# EAGLE schematic main_board_v1 (EAGLE 9.2.2)

## Sheet 1 of 7: MCU
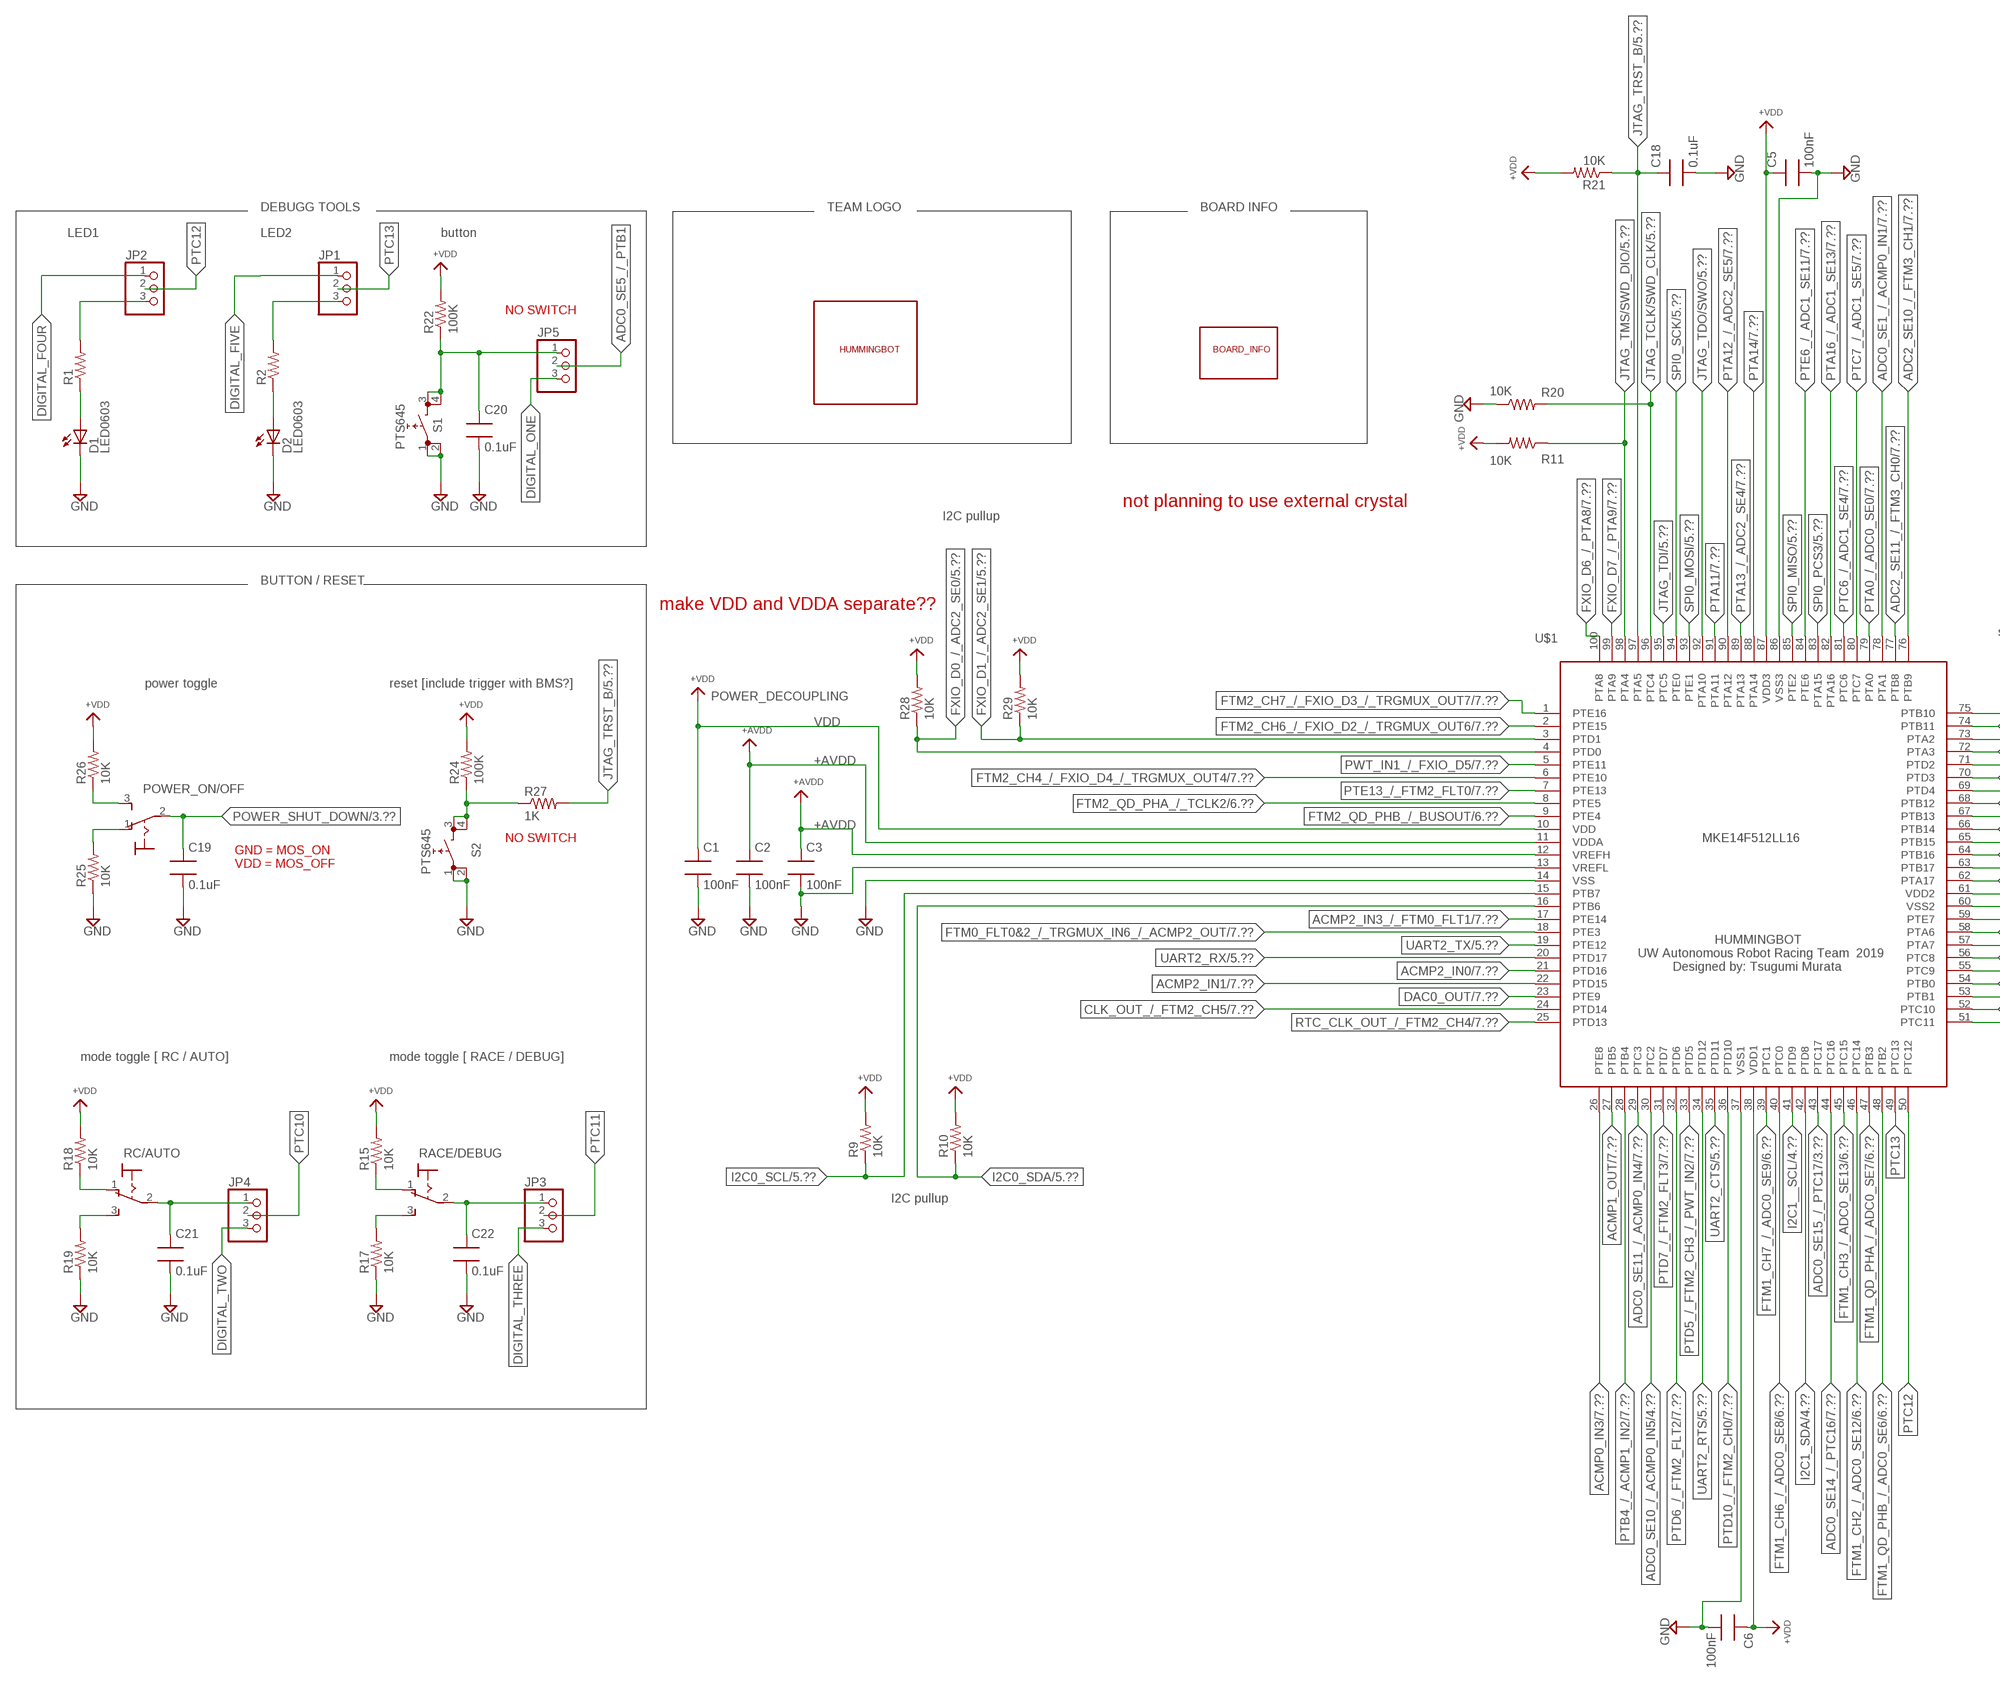
[diagram p0: schematic, sheet 1, part 1 of 2]
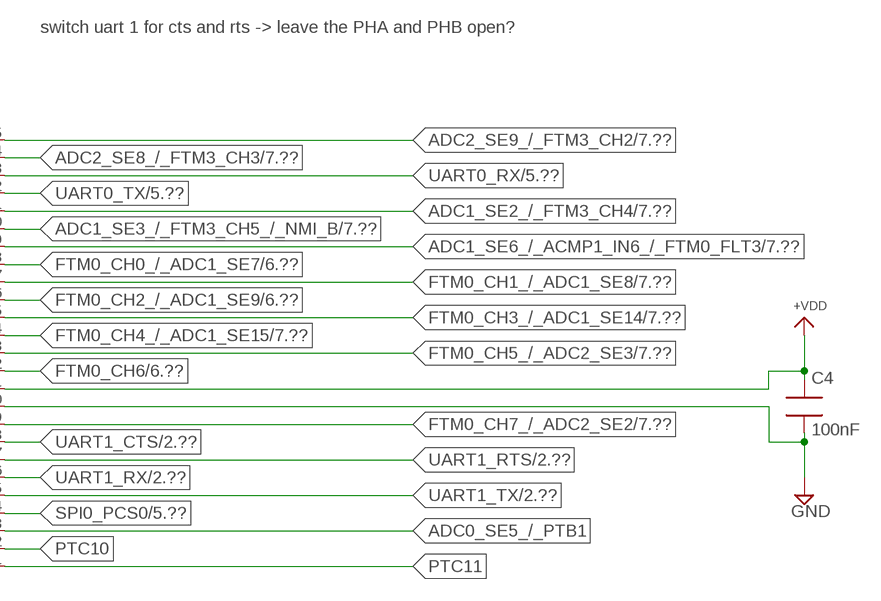
[diagram p1: schematic, sheet 1, part 2 of 2]

### Parts
C1  100nF  CAP0603  [0603SMT]
C2  100nF  CAP0603  [0603SMT]
C3  100nF  CAP0603  [0603SMT]
C4  100nF  CAP0603  [0603SMT]
C5  100nF  CAP0603  [0603SMT]
C6  100nF  CAP0603  [0603SMT]
C18  0.1uF  CAP0603  [0603SMT]
C19  0.1uF  CAP0603  [0603SMT]
C20  0.1uF  CAP0603  [0603SMT]
C21  0.1uF  CAP0603  [0603SMT]
C22  0.1uF  CAP0603  [0603SMT]
D1  LED0603  [0603SMT]
D2  LED0603  [0603SMT]
JP1  PINHD-1X3  [1X03]
JP2  PINHD-1X3  [1X03]
JP3  PINHD-1X3  [1X03]
JP4  PINHD-1X3  [1X03]
JP5  PINHD-1X3  [1X03]
POWER_ON/OFF  320-916  [320-916]
R1  RES0603  [0603SMT]
R2  RES0603  [0603SMT]
R9  10K  RES0603  [0603SMT]
R10  10K  RES0603  [0603SMT]
R11  10K  RES0603  [0603SMT]
R15  10K  RES0603  [0603SMT]
R17  10K  RES0603  [0603SMT]
R18  10K  RES0603  [0603SMT]
R19  10K  RES0603  [0603SMT]
R20  10K  RES0603  [0603SMT]
R21  10K  RES0603  [0603SMT]
R22  100K  RES0603  [0603SMT]
R24  100K  RES0603  [0603SMT]
R25  10K  RES0603  [0603SMT]
R26  10K  RES0603  [0603SMT]
R27  1K  RES0603  [0603SMT]
R28  10K  RES0603  [0603SMT]
R29  10K  RES0603  [0603SMT]
RACE/DEBUG  320-916  [320-916]
RC/AUTO  320-916  [320-916]
S1  PTS645  TACT_SWITCH_6X6_SMT  [TACT_SWITCH_SMT]
S2  PTS645  TACT_SWITCH_6X6_SMT  [TACT_SWITCH_SMT]
U$1  MKE14F512LL16  [LQFP100]
U$12  TEAM_LOGO  [TEAM_LOGO]
U$38  BOARD_INFO  [BOARD_INFO]

### Nets
+AVDD: C2.1 C3.1 U$1.11(VDDA) U$1.12(VREFH)
ACMP0_IN3: U$1.26(PTE8) ; also sheet 7
ACMP1_OUT: U$1.27(PTB5) ; also sheet 7
ACMP2_IN0: U$1.21(PTD16) ; also sheet 7
ACMP2_IN1: U$1.22(PTD15) ; also sheet 7
ACMP2_IN3_/_FTM0_FLT1: U$1.17(PTE14) ; also sheet 7
ADC0_SE1_/_ACMP0_IN1: U$1.78(PTA1) ; also sheet 7
ADC0_SE5_/_PTB1: JP5.2 U$1.53(PTB1)
ADC0_SE10_/_ACMP0_IN5: U$1.30(PTC2) ; also sheet 4,7
ADC0_SE11_/_ACMP0_IN4: U$1.29(PTC3) ; also sheet 7
ADC0_SE14_/_PTC16: U$1.44(PTC16) ; also sheet 7
ADC0_SE15_/_PTC17: U$1.43(PTC17) ; also sheet 3,7
ADC1_SE2_/_FTM3_CH4: U$1.71(PTD2) ; also sheet 7
ADC1_SE3_/_FTM3_CH5_/_NMI_B: U$1.70(PTD3) ; also sheet 7
ADC1_SE6_/_ACMP1_IN6_/_FTM0_FLT3: U$1.69(PTD4) ; also sheet 7
ADC2_SE8_/_FTM3_CH3: U$1.74(PTB11) ; also sheet 7
ADC2_SE9_/_FTM3_CH2: U$1.75(PTB10) ; also sheet 7
ADC2_SE10_/_FTM3_CH1: U$1.76(PTB9) ; also sheet 7
ADC2_SE11_/_FTM3_CH0: U$1.77(PTB8) ; also sheet 7
CLK_OUT_/_FTM2_CH5: U$1.24(PTD14) ; also sheet 7
DAC0_OUT: U$1.23(PTE9) ; also sheet 7
DIGITAL_FIVE: JP1.1
DIGITAL_FOUR: JP2.1
DIGITAL_ONE: JP5.3
DIGITAL_THREE: JP3.3
DIGITAL_TWO: JP4.3
FTM0_CH0_/_ADC1_SE7: U$1.68(PTB12) ; also sheet 6,7
FTM0_CH1_/_ADC1_SE8: U$1.67(PTB13) ; also sheet 7
FTM0_CH2_/_ADC1_SE9: U$1.66(PTB14) ; also sheet 6,7
FTM0_CH3_/_ADC1_SE14: U$1.65(PTB15) ; also sheet 7
FTM0_CH4_/_ADC1_SE15: U$1.64(PTB16) ; also sheet 7
FTM0_CH5_/_ADC2_SE3: U$1.63(PTB17) ; also sheet 7
FTM0_CH6: U$1.62(PTA17) ; also sheet 6,7
FTM0_CH7_/_ADC2_SE2: U$1.59(PTE7) ; also sheet 7
FTM0_FLT0&2_/_TRGMUX_IN6_/_ACMP2_OUT: U$1.18(PTE3) ; also sheet 7
FTM1_CH2_/_ADC0_SE12: U$1.46(PTC14) ; also sheet 6
FTM1_CH3_/_ADC0_SE13: U$1.45(PTC15) ; also sheet 6
FTM1_CH6_/_ADC0_SE8: U$1.40(PTC0) ; also sheet 6
FTM1_CH7_/_ADC0_SE9: U$1.39(PTC1) ; also sheet 6
FTM1_QD_PHA_/_ADC0_SE7: U$1.47(PTB3) ; also sheet 6
FTM1_QD_PHB_/_ADC0_SE6: U$1.48(PTB2) ; also sheet 6
FTM2_CH4_/_FXIO_D4_/_TRGMUX_OUT4: U$1.6(PTE10) ; also sheet 7
FTM2_CH6_/_FXIO_D2_/_TRGMUX_OUT6: U$1.2(PTE15) ; also sheet 7
FTM2_CH7_/_FXIO_D3_/_TRGMUX_OUT7: U$1.1(PTE16) ; also sheet 7
FTM2_QD_PHA_/_TCLK2: U$1.8(PTE5) ; also sheet 6
FTM2_QD_PHB_/_BUSOUT: U$1.9(PTE4) ; also sheet 6
FXIO_D0_/_ADC2_SE0: R28.1 U$1.4(PTD0) ; also sheet 5,7
FXIO_D1_/_ADC2_SE1: R29.1 U$1.3(PTD1) ; also sheet 5,7
FXIO_D6_/_PTA8: U$1.100(PTA8) ; also sheet 7
FXIO_D7_/_PTA9: U$1.99(PTA9) ; also sheet 7
GND: C1.2 C2.2 C3.2 C4.2 C5.2 C6.2 C18.2 C19.2 C20.2 C21.2 C22.2 D1.2(C) D2.2(C) R17.1 R19.1 R20.1 R25.1 S1.1 S1.2 S2.1 S2.2 U$1.13(VREFL) U$1.14(VSS) U$1.37(VSS1) U$1.60(VSS2) U$1.86(VSS3) ; also sheet 2,3,4,5,6,7
I2C0_SCL: R9.1 U$1.15(PTB7) ; also sheet 5
I2C0_SDA: R10.1 U$1.16(PTB6) ; also sheet 5
I2C1__SCL: U$1.41(PTD9) ; also sheet 4
I2C1_SDA: U$1.42(PTD8) ; also sheet 4
JTAG_TCLK/SWD_CLK: R20.2 U$1.96(PTC4) ; also sheet 5
JTAG_TDI: U$1.95(PTC5) ; also sheet 5
JTAG_TDO/SWO: U$1.92(PTA10) ; also sheet 5
JTAG_TMS/SWD_DIO: R11.1 U$1.98(PTA4) ; also sheet 5
JTAG_TRST_B: C18.1 R21.1 R24.1 R27.1 R27.2 S2.3 S2.4 U$1.97(PTA5) ; also sheet 5
N$3: D1.1(A) R1.1
N$4: C22.1 JP3.1 RACE/DEBUG.2(P)
N$5: D2.1(A) R2.1
N$6: JP1.3 R2.2
N$7: JP2.3 R1.2
N$26: R15.1 RACE/DEBUG.1(O)
N$28: R17.2 RACE/DEBUG.3(S)
N$31: C21.1 JP4.1 RC/AUTO.2(P)
N$32: R18.1 RC/AUTO.1(O)
N$33: R19.2 RC/AUTO.3(S)
N$41: C20.1 JP5.1 R22.1 S1.3 S1.4
N$45: POWER_ON/OFF.3(S) R26.1
N$46: POWER_ON/OFF.1(O) R25.2
POWER_SHUT_DOWN: C19.1 POWER_ON/OFF.2(P) ; also sheet 3
PTA0_/_ADC0_SE0: U$1.79(PTA0) ; also sheet 7
PTA11: U$1.91(PTA11) ; also sheet 7
PTA12_/_ADC2_SE5: U$1.90(PTA12) ; also sheet 7
PTA13_/_ADC2_SE4: U$1.89(PTA13) ; also sheet 7
PTA14: U$1.88(PTA14) ; also sheet 7
PTA16_/_ADC1_SE13: U$1.82(PTA16) ; also sheet 7
PTB4_/_ACMP1_IN2: U$1.28(PTB4) ; also sheet 7
PTC6_/_ADC1_SE4: U$1.81(PTC6) ; also sheet 7
PTC7_/_ADC1_SE5: U$1.80(PTC7) ; also sheet 7
PTC10: JP4.2 U$1.52(PTC10)
PTC11: JP3.2 U$1.51(PTC11)
PTC12: JP2.2 U$1.50(PTC12)
PTC13: JP1.2 U$1.49(PTC13)
PTD5_/_FTM2_CH3_/_PWT_IN2: U$1.33(PTD5) ; also sheet 7
PTD6_/_FTM2_FLT2: U$1.32(PTD6) ; also sheet 7
PTD7_/_FTM2_FLT3: U$1.31(PTD7) ; also sheet 7
PTD10_/_FTM2_CH0: U$1.36(PTD10) ; also sheet 7
PTE6_/_ADC1_SE11: U$1.84(PTE6) ; also sheet 7
PTE13_/_FTM2_FLT0: U$1.7(PTE13) ; also sheet 7
PWT_IN1_/_FXIO_D5: U$1.5(PTE11) ; also sheet 7
RTC_CLK_OUT_/_FTM2_CH4: U$1.25(PTD13) ; also sheet 7
SPI0_MISO: U$1.85(PTE2) ; also sheet 5
SPI0_MOSI: U$1.93(PTE1) ; also sheet 5
SPI0_PCS0: U$1.54(PTB0) ; also sheet 5
SPI0_PCS3: U$1.83(PTA15) ; also sheet 5
SPI0_SCK: U$1.94(PTE0) ; also sheet 5
UART0_RX: U$1.73(PTA2) ; also sheet 5
UART0_TX: U$1.72(PTA3) ; also sheet 5
UART1_CTS: U$1.58(PTA6) ; also sheet 2
UART1_RTS: U$1.57(PTA7) ; also sheet 2
UART1_RX: U$1.56(PTC8) ; also sheet 2
UART1_TX: U$1.55(PTC9) ; also sheet 2
UART2_CTS: U$1.35(PTD11) ; also sheet 5
UART2_RTS: U$1.34(PTD12) ; also sheet 5
UART2_RX: U$1.20(PTD17) ; also sheet 5
UART2_TX: U$1.19(PTE12) ; also sheet 5
VDD: C1.1 C4.1 C5.1 C6.1 R9.2 R10.2 R11.2 R15.2 R18.2 R21.2 R22.2 R24.2 R26.2 R28.2 R29.2 U$1.10(VDD) U$1.38(VDD1) U$1.61(VDD2) U$1.87(VDD3) ; supply symbol labelled +VDD ; also sheet 5,6,7

### Notes on the sheet
- DEBUGG TOOLS | TEAM LOGO | BOARD INFO
- LED1 | LED2 | button
- NO SWITCH
- not planning to use external crystal
- I2C pullup
- BUTTON / RESET
- make VDD and VDDA separate??
- switch uart 1 for cts and rts -> leave the PHA and PHB open?
- power toggle | reset [include trigger with BMS?]
- POWER_DECOUPLING
- NO SWITCH
- GND = MOS_ON 
  VDD = MOS_OFF
- HUMMINGBOT 
  UW Autonomous Robot Racing Team  2019 
            Designed by: Tsugumi Murata
- mode toggle [ RC / AUTO] | mode toggle [ RACE / DEBUG]
- I2C pullup

## Sheet 2 of 7: USB Interface [Programming / Debug]
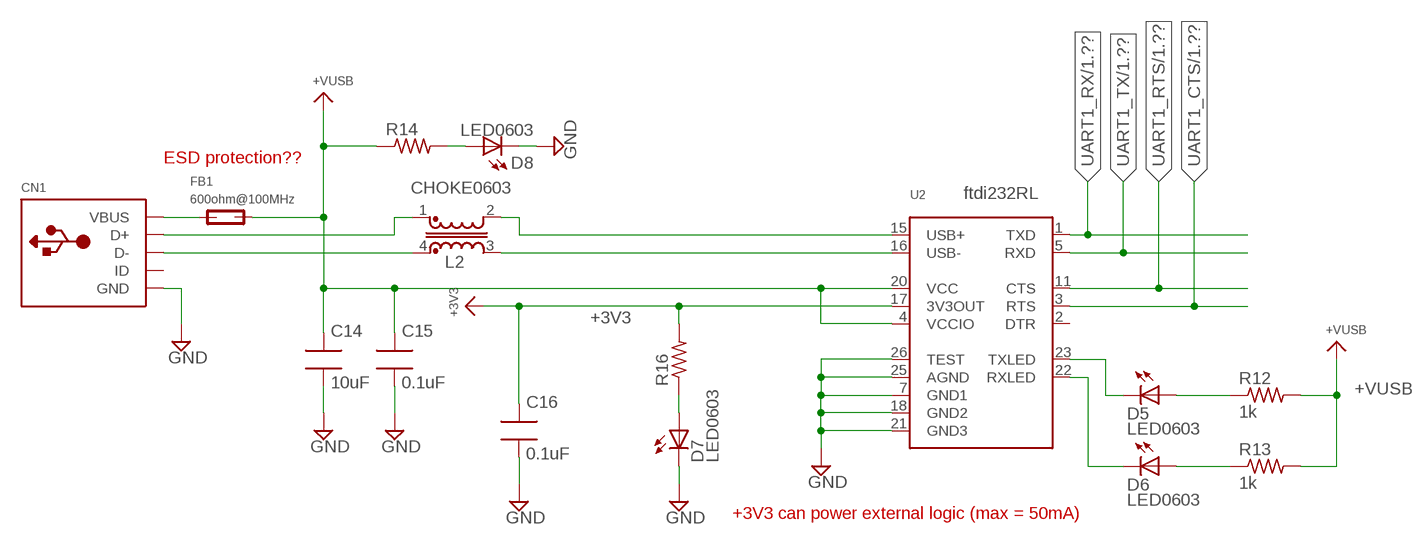
[diagram p2: schematic, sheet 2]

### Parts
C14  10uF  CAP0603  [0603SMT]
C15  0.1uF  CAP0603  [0603SMT]
C16  0.1uF  CAP0603  [0603SMT]
CN1  USBMINIB  [USB-MINIB]
D5  LED0603  [0603SMT]
D6  LED0603  [0603SMT]
D7  LED0603  [0603SMT]
D8  LED0603  [0603SMT]
FB1  600ohm@100MHz  FERRITE_BEAD  [0603SMT]
L2  CHOKE0603  [CHOKE0603]
R12  1k  RES0603  [0603SMT]
R13  1k  RES0603  [0603SMT]
R14  RES0603  [0603SMT]
R16  RES0603  [0603SMT]
U2  FT232RLSSOP28  [SSOP28DB]

### Nets
+3V3: C16.1 R16.2 U2.17(3V3OUT) ; also sheet 3
+VUSB: C14.1 C15.1 FB1.2 R12.2 R13.2 R14.1 U2.4(VCCIO) U2.20(VCC)
GND: C14.2 C15.2 C16.2 CN1.GND D7.2(C) D8.2(C) U2.7(GND1) U2.18(GND2) U2.21(GND3) U2.25(AGND) U2.26(TEST) ; also sheet 1,3,4,5,6,7
N$1: D7.1(A) R16.1
N$2: D8.1(A) R14.2
N$12: L2.2 U2.15(USB+)
N$13: L2.3 U2.16(USB-)
N$14: D5.2(C) U2.23(TXLED)
N$15: D5.1(A) R12.1
N$16: CN1.D+ L2.1
N$17: D6.2(C) U2.22(RXLED)
N$18: D6.1(A) R13.1
N$19: CN1.D- L2.4
N$25: CN1.VBUS FB1.1
UART1_CTS: U2.3(RTS) ; also sheet 1
UART1_RTS: U2.11(CTS) ; also sheet 1
UART1_RX: U2.1(TXD) ; also sheet 1
UART1_TX: U2.5(RXD) ; also sheet 1
Unconnected: CN1.ID U2.2(DTR)

### Notes on the sheet
- ESD protection??
- ftdi232RL
- +3V3 can power external logic (max = 50mA)

## Sheet 3 of 7: POWER REGULATOR / SHUTDOWN
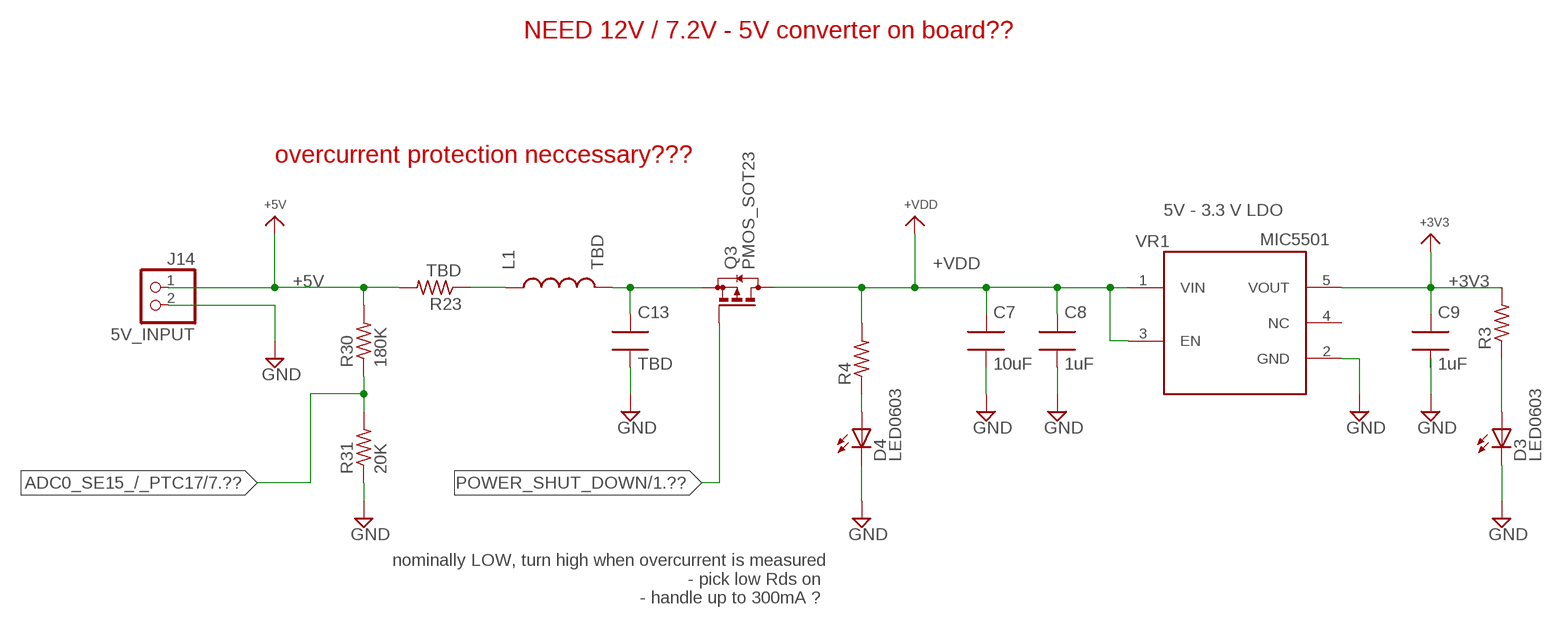
[diagram p3: schematic, sheet 3]

### Parts
C7  10uF  CAP0603  [0603SMT]
C8  1uF  CAP0603  [0603SMT]
C9  1uF  CAP0603  [0603SMT]
C13  TBD  CAP0603  [0603SMT]
D3  LED0603  [0603SMT]
D4  LED0603  [0603SMT]
J14  5V_INPUT  PINHEAD-2-VERTICAL  [JST_B2B-PH-K-S(LF)(SN)]
L1  TBD  IND0603  [0603SMT]
Q3  PMOS_SOT23  [SOT23]
R3  RES0603  [0603SMT]
R4  RES0603  [0603SMT]
R23  TBD  RES0603  [0603SMT]
R30  180K  RES0603  [0603SMT]
R31  20K  RES0603  [0603SMT]
VR1  MIC5501  [SOT23-5]

### Nets
+3V3: C9.1 R3.2 VR1.5(VOUT) ; also sheet 2
+5V: J14.1 R23.2 R30.2
+VDD: C7.1 C8.1 Q3.3(D) R4.2 VR1.1(VIN) VR1.3(EN) ; also sheet 4,5
ADC0_SE15_/_PTC17: R30.1 R31.2 ; also sheet 1,7
GND: C7.2 C8.2 C9.2 C13.2 D3.2(C) D4.2(C) J14.2 R31.1 VR1.2(GND) ; also sheet 1,2,4,5,6,7
N$8: D3.1(A) R3.1
N$9: D4.1(A) R4.1
N$11: L1.1 R23.1
N$20: C13.1 L1.2 Q3.2(S)
POWER_SHUT_DOWN: Q3.1(G) ; also sheet 1
Unconnected: VR1.4(NC)

### Notes on the sheet
- NEED 12V / 7.2V - 5V converter on board??
- overcurrent protection neccessary???
- 5V - 3.3 V LDO
- nominally LOW, turn high when overcurrent is measured
  - pick low Rds on 
  - handle up to 300mA ?

## Sheet 4 of 7: IMU / Bi- Directional Level Shifter
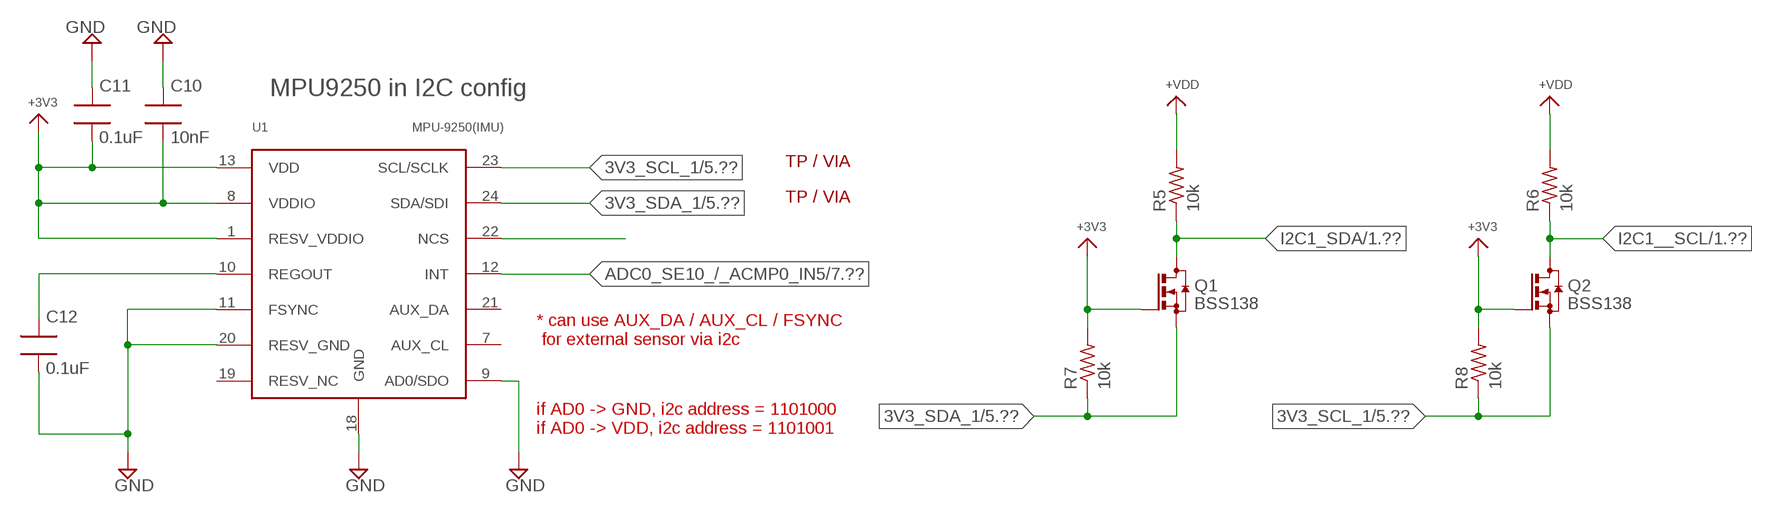
[diagram p4: schematic, sheet 4]

### Parts
C10  10nF  CAP0603  [0603SMT]
C11  0.1uF  CAP0603  [0603SMT]
C12  0.1uF  CAP0603  [0603SMT]
Q1  BSS138  NMOS_SOT23  [SOT23]
Q2  BSS138  NMOS_SOT23  [SOT23]
R5  10k  RES0603  [0603SMT]
R6  10k  RES0603  [0603SMT]
R7  10k  RES0603  [0603SMT]
R8  10k  RES0603  [0603SMT]
U1  MPU-9250(IMU)  [QFN24-3X3]

### Nets
3V3_SCL_1: Q2.2(S) R8.1 U1.23(SCL/SCLK) ; also sheet 5
3V3_SDA_1: Q1.2(S) R7.1 U1.24(SDA/SDI) ; also sheet 5
+VDD: C10.2 C11.2 Q1.1(G) Q2.1(G) R5.2 R6.2 R7.2 R8.2 U1.1(RESV_VDDIO) U1.8(VDDIO) U1.13(VDD) U1.22(NCS) ; supply symbol labelled +3V3 ; also sheet 3,5
ADC0_SE10_/_ACMP0_IN5: U1.12(INT) ; also sheet 1,7
GND: C10.1 C11.1 C12.2 U1.9(AD0/SDO) U1.11(FSYNC) U1.18(GND) U1.20(RESV_GND) ; also sheet 1,2,3,5,6,7
I2C1__SCL: Q2.3(D) R6.1 ; also sheet 1
I2C1_SDA: Q1.3(D) R5.1 ; also sheet 1
N$10: C12.1 U1.10(REGOUT)
Unconnected: U1.7(AUX_CL) U1.19(RESV_NC) U1.21(AUX_DA)

### Notes on the sheet
- MPU9250 in I2C config
- TP / VIA
- TP / VIA
- * can use AUX_DA / AUX_CL / FSYNC
   for external sensor via i2c
- if AD0 -> GND, i2c address = 1101000
  if AD0 -> VDD, i2c address = 1101001

## Sheet 5 of 7: Communication ( I2C / SPI / UART / SWD / JTAG )
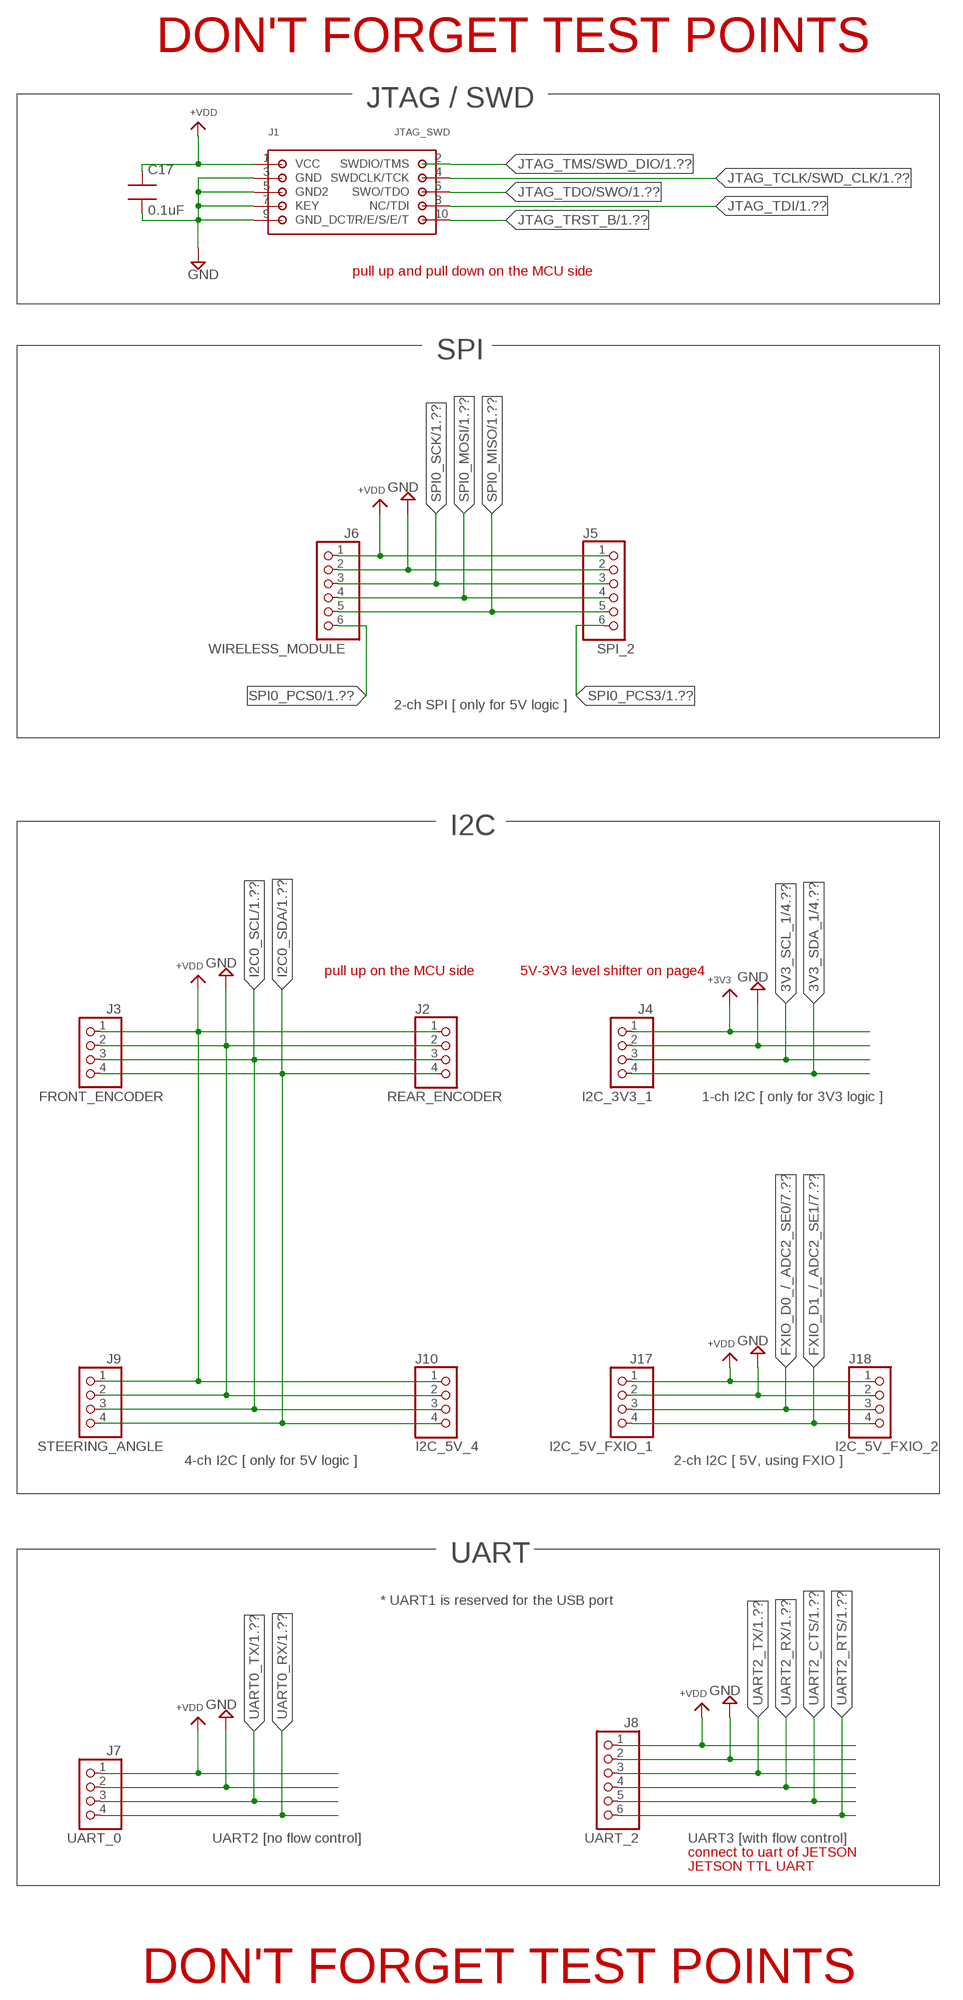
[diagram p5: schematic, sheet 5]

### Parts
C17  0.1uF  CAP0603  [0603SMT]
J1  JTAG_SWD  10-PIN_SWD  [CORTEXM3_SWD10_MOLEX]
J2  REAR_ENCODER  PINHEAD-4-VERTICAL  [JST_B4B-PH-K-S(LF)(SN)]
J3  FRONT_ENCODER  PINHEAD-4-VERTICAL  [JST_B4B-PH-K-S(LF)(SN)]
J4  I2C_3V3_1  PINHEAD-4-VERTICAL  [JST_B4B-PH-K-S(LF)(SN)]
J5  SPI_2  PINHEAD-6-VERTICAL  [JST_B6B-PH-K-S(LF)(SN)]
J6  WIRELESS_MODULE  PINHEAD-6-VERTICAL  [JST_B6B-PH-K-S(LF)(SN)]
J7  UART_0  PINHEAD-4-VERTICAL  [JST_B4B-PH-K-S(LF)(SN)]
J8  UART_2  PINHEAD-6-VERTICAL  [JST_B6B-PH-K-S(LF)(SN)]
J9  STEERING_ANGLE  PINHEAD-4-VERTICAL  [JST_B4B-PH-K-S(LF)(SN)]
J10  I2C_5V_4  PINHEAD-4-VERTICAL  [JST_B4B-PH-K-S(LF)(SN)]
J17  I2C_5V_FXIO_1  PINHEAD-4-VERTICAL  [JST_B4B-PH-K-S(LF)(SN)]
J18  I2C_5V_FXIO_2  PINHEAD-4-VERTICAL  [JST_B4B-PH-K-S(LF)(SN)]

### Nets
3V3_SCL_1: J4.3 ; also sheet 4
3V3_SDA_1: J4.4 ; also sheet 4
+VDD: C17.1 J1.1(VCC) J2.1 J3.1 J4.1 J5.1 J6.1 J7.1 J8.1 J9.1 J10.1 ; supply symbol labelled +3V3 ; also sheet 3,4
FXIO_D0_/_ADC2_SE0: J17.3 J18.3 ; also sheet 1,7
FXIO_D1_/_ADC2_SE1: J17.4 J18.4 ; also sheet 1,7
GND: C17.2 J1.3(GND) J1.5(GND2) J1.7(KEY) J1.9(GND_DCT) J2.2 J3.2 J4.2 J5.2 J6.2 J7.2 J8.2 J9.2 J10.2 J17.2 J18.2 ; also sheet 1,2,3,4,6,7
I2C0_SCL: J2.3 J3.3 J9.3 J10.3 ; also sheet 1
I2C0_SDA: J2.4 J3.4 J9.4 J10.4 ; also sheet 1
JTAG_TCLK/SWD_CLK: J1.4(SWDCLK/TCK) ; also sheet 1
JTAG_TDI: J1.8(NC/TDI) ; also sheet 1
JTAG_TDO/SWO: J1.6(SWO/TDO) ; also sheet 1
JTAG_TMS/SWD_DIO: J1.2(SWDIO/TMS) ; also sheet 1
JTAG_TRST_B: J1.10(/R/E/S/E/T) ; also sheet 1
SPI0_MISO: J5.5 J6.5 ; also sheet 1
SPI0_MOSI: J5.4 J6.4 ; also sheet 1
SPI0_PCS0: J6.6 ; also sheet 1
SPI0_PCS3: J5.6 ; also sheet 1
SPI0_SCK: J5.3 J6.3 ; also sheet 1
UART0_RX: J7.4 ; also sheet 1
UART0_TX: J7.3 ; also sheet 1
UART2_CTS: J8.5 ; also sheet 1
UART2_RTS: J8.6 ; also sheet 1
UART2_RX: J8.4 ; also sheet 1
UART2_TX: J8.3 ; also sheet 1
VDD: J17.1 J18.1 ; supply symbol labelled +VDD ; also sheet 1,6,7

### Notes on the sheet
- DON'T FORGET TEST POINTS
- JTAG / SWD
- pull up and pull down on the MCU side
- SPI
- 2-ch SPI [ only for 5V logic ]
- I2C
- pull up on the MCU side | 5V-3V3 level shifter on page4
- 1-ch I2C [ only for 3V3 logic ]
- 4-ch I2C [ only for 5V logic ] | 2-ch I2C [ 5V, using FXIO ]
- UART
- * UART1 is reserved for the USB port
- UART2 [no flow control] | UART3 [with flow control]
- connect to uart of JETSON
- JETSON TTL UART
- DON'T FORGET TEST POINTS

## Sheet 6 of 7: SENSOR / ACTUATOR
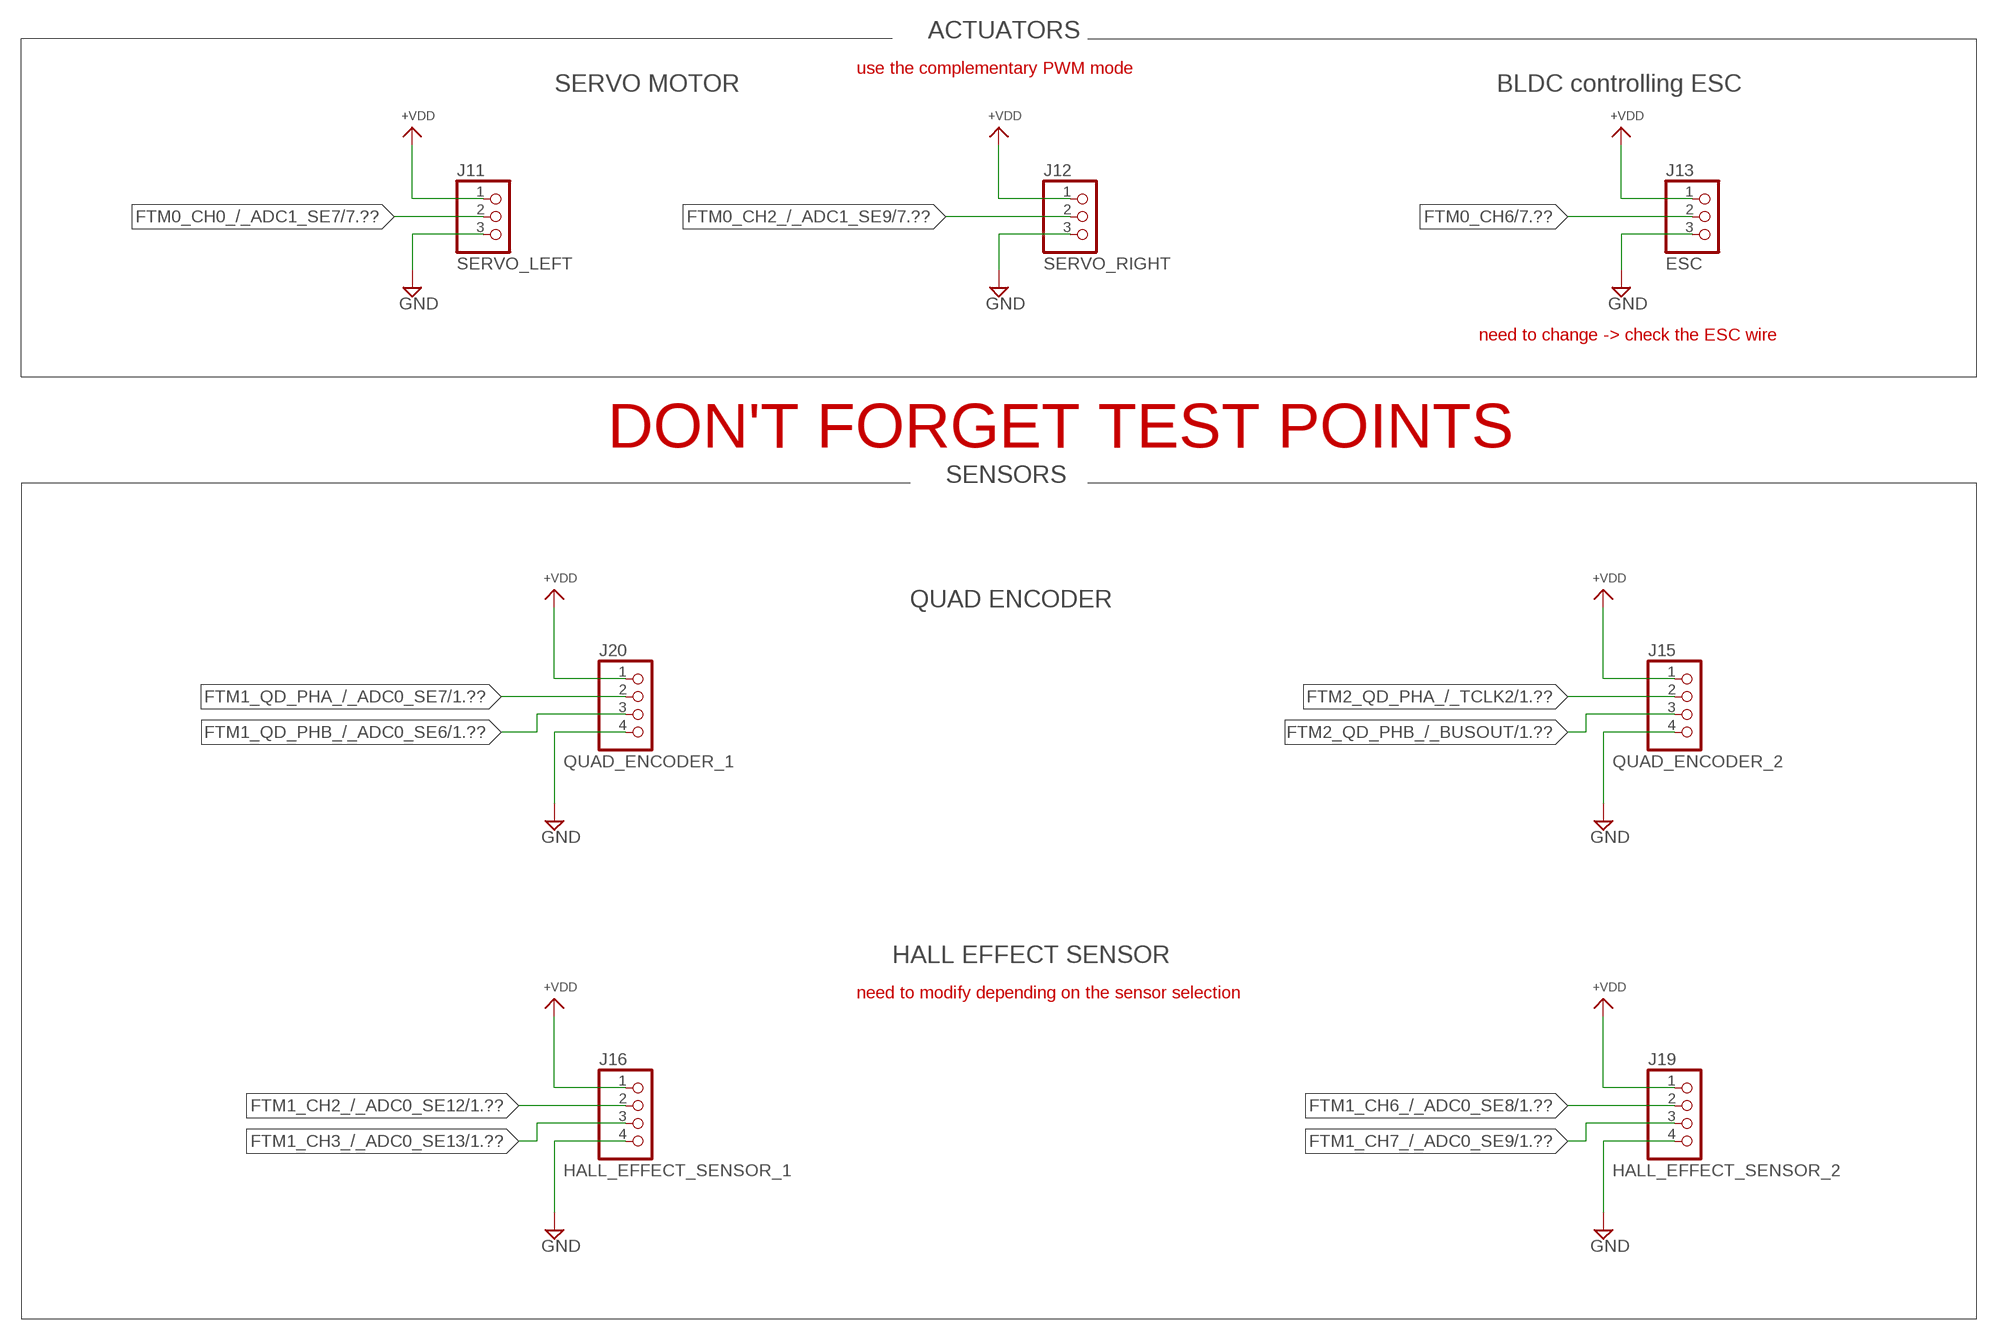
[diagram p6: schematic, sheet 6]

### Parts
J11  SERVO_LEFT  PINHEAD-3-VERTICAL  [JST_B3B-PH-K-S(LF)(SN)]
J12  SERVO_RIGHT  PINHEAD-3-VERTICAL  [JST_B3B-PH-K-S(LF)(SN)]
J13  ESC  PINHEAD-3-VERTICAL  [JST_B3B-PH-K-S(LF)(SN)]
J15  QUAD_ENCODER_2  PINHEAD-4-VERTICAL  [JST_B4B-PH-K-S(LF)(SN)]
J16  HALL_EFFECT_SENSOR_1  PINHEAD-4-VERTICAL  [JST_B4B-PH-K-S(LF)(SN)]
J19  HALL_EFFECT_SENSOR_2  PINHEAD-4-VERTICAL  [JST_B4B-PH-K-S(LF)(SN)]
J20  QUAD_ENCODER_1  PINHEAD-4-VERTICAL  [JST_B4B-PH-K-S(LF)(SN)]

### Nets
FTM0_CH0_/_ADC1_SE7: J11.2 ; also sheet 1,7
FTM0_CH2_/_ADC1_SE9: J12.2 ; also sheet 1,7
FTM0_CH6: J13.2 ; also sheet 1,7
FTM1_CH2_/_ADC0_SE12: J16.2 ; also sheet 1
FTM1_CH3_/_ADC0_SE13: J16.3 ; also sheet 1
FTM1_CH6_/_ADC0_SE8: J19.2 ; also sheet 1
FTM1_CH7_/_ADC0_SE9: J19.3 ; also sheet 1
FTM1_QD_PHA_/_ADC0_SE7: J20.2 ; also sheet 1
FTM1_QD_PHB_/_ADC0_SE6: J20.3 ; also sheet 1
FTM2_QD_PHA_/_TCLK2: J15.2 ; also sheet 1
FTM2_QD_PHB_/_BUSOUT: J15.3 ; also sheet 1
GND: J11.3 J12.3 J13.3 J15.4 J16.4 J19.4 J20.4 ; also sheet 1,2,3,4,5,7
N$36: J11.1 ; supply symbol labelled +VDD
N$39: J12.1 ; supply symbol labelled +VDD
N$42: J13.1 ; supply symbol labelled +VDD
VDD: J15.1 J16.1 J19.1 J20.1 ; supply symbol labelled +VDD ; also sheet 1,5,7

### Notes on the sheet
- ACTUATORS
- use the complementary PWM mode
- SERVO MOTOR | BLDC controlling ESC
- need to change -> check the ESC wire
- DON'T FORGET TEST POINTS
- SENSORS
- QUAD ENCODER
- HALL EFFECT SENSOR
- need to modify depending on the sensor selection

## Sheet 7 of 7: GPIO HEADER / CONNECTOR
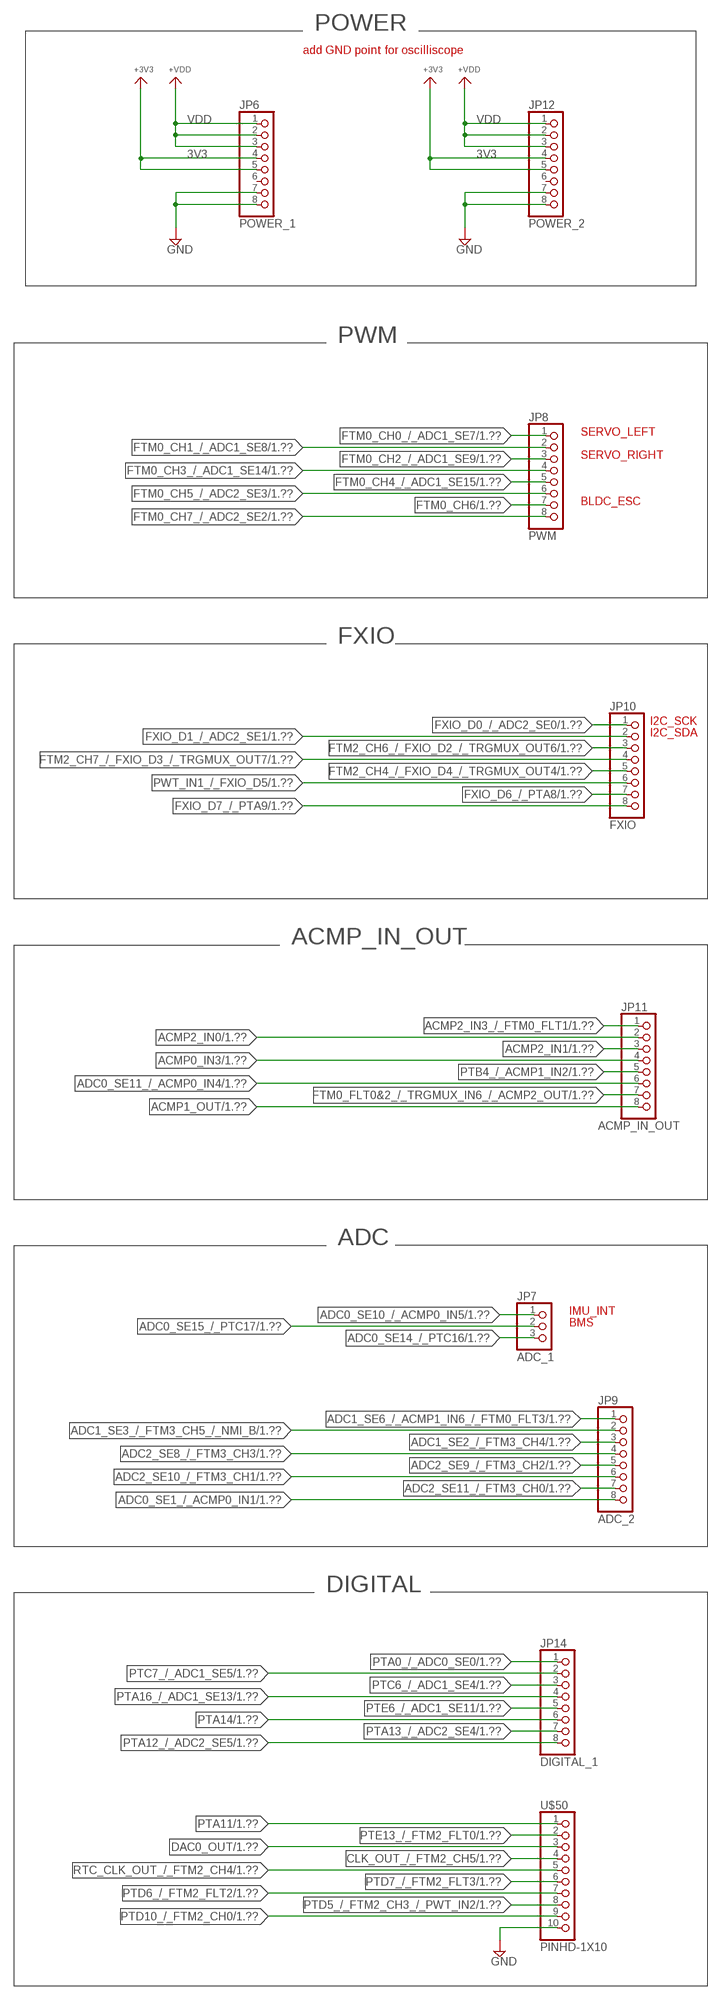
[diagram p7: schematic, sheet 7]

### Parts
JP6  POWER_1  PINHD-1X8BIG  [1X08-BIG]
JP7  ADC_1  PINHD-1X3  [1X03]
JP8  PWM  PINHD-1X8BIG  [1X08-BIG]
JP9  ADC_2  PINHD-1X8BIG  [1X08-BIG]
JP10  FXIO  PINHD-1X8BIG  [1X08-BIG]
JP11  ACMP_IN_OUT  PINHD-1X8BIG  [1X08-BIG]
JP12  POWER_2  PINHD-1X8BIG  [1X08-BIG]
JP14  DIGITAL_1  PINHD-1X8BIG  [1X08-BIG]
U$50  PINHD-1X10  [1X10-BIG]

### Nets
3V3: JP6.4 JP6.5 JP12.4 JP12.5 ; supply symbol labelled +3V3
ACMP0_IN3: JP11.4 ; also sheet 1
ACMP1_OUT: JP11.8 ; also sheet 1
ACMP2_IN0: JP11.2 ; also sheet 1
ACMP2_IN1: JP11.3 ; also sheet 1
ACMP2_IN3_/_FTM0_FLT1: JP11.1 ; also sheet 1
ADC0_SE1_/_ACMP0_IN1: JP9.8 ; also sheet 1
ADC0_SE10_/_ACMP0_IN5: JP7.1 ; also sheet 1,4
ADC0_SE11_/_ACMP0_IN4: JP11.6 ; also sheet 1
ADC0_SE14_/_PTC16: JP7.3 ; also sheet 1
ADC0_SE15_/_PTC17: JP7.2 ; also sheet 1,3
ADC1_SE2_/_FTM3_CH4: JP9.3 ; also sheet 1
ADC1_SE3_/_FTM3_CH5_/_NMI_B: JP9.2 ; also sheet 1
ADC1_SE6_/_ACMP1_IN6_/_FTM0_FLT3: JP9.1 ; also sheet 1
ADC2_SE8_/_FTM3_CH3: JP9.4 ; also sheet 1
ADC2_SE9_/_FTM3_CH2: JP9.5 ; also sheet 1
ADC2_SE10_/_FTM3_CH1: JP9.6 ; also sheet 1
ADC2_SE11_/_FTM3_CH0: JP9.7 ; also sheet 1
CLK_OUT_/_FTM2_CH5: U$50.4 ; also sheet 1
DAC0_OUT: U$50.3 ; also sheet 1
FTM0_CH0_/_ADC1_SE7: JP8.1 ; also sheet 1,6
FTM0_CH1_/_ADC1_SE8: JP8.2 ; also sheet 1
FTM0_CH2_/_ADC1_SE9: JP8.3 ; also sheet 1,6
FTM0_CH3_/_ADC1_SE14: JP8.4 ; also sheet 1
FTM0_CH4_/_ADC1_SE15: JP8.5 ; also sheet 1
FTM0_CH5_/_ADC2_SE3: JP8.6 ; also sheet 1
FTM0_CH6: JP8.7 ; also sheet 1,6
FTM0_CH7_/_ADC2_SE2: JP8.8 ; also sheet 1
FTM0_FLT0&2_/_TRGMUX_IN6_/_ACMP2_OUT: JP11.7 ; also sheet 1
FTM2_CH4_/_FXIO_D4_/_TRGMUX_OUT4: JP10.5 ; also sheet 1
FTM2_CH6_/_FXIO_D2_/_TRGMUX_OUT6: JP10.3 ; also sheet 1
FTM2_CH7_/_FXIO_D3_/_TRGMUX_OUT7: JP10.4 ; also sheet 1
FXIO_D0_/_ADC2_SE0: JP10.1 ; also sheet 1,5
FXIO_D1_/_ADC2_SE1: JP10.2 ; also sheet 1,5
FXIO_D6_/_PTA8: JP10.7 ; also sheet 1
FXIO_D7_/_PTA9: JP10.8 ; also sheet 1
GND: JP6.7 JP6.8 JP12.7 JP12.8 U$50.10 ; also sheet 1,2,3,4,5,6
PTA0_/_ADC0_SE0: JP14.1 ; also sheet 1
PTA11: U$50.1 ; also sheet 1
PTA12_/_ADC2_SE5: JP14.8 ; also sheet 1
PTA13_/_ADC2_SE4: JP14.7 ; also sheet 1
PTA14: JP14.6 ; also sheet 1
PTA16_/_ADC1_SE13: JP14.4 ; also sheet 1
PTB4_/_ACMP1_IN2: JP11.5 ; also sheet 1
PTC6_/_ADC1_SE4: JP14.3 ; also sheet 1
PTC7_/_ADC1_SE5: JP14.2 ; also sheet 1
PTD5_/_FTM2_CH3_/_PWT_IN2: U$50.8 ; also sheet 1
PTD6_/_FTM2_FLT2: U$50.7 ; also sheet 1
PTD7_/_FTM2_FLT3: U$50.6 ; also sheet 1
PTD10_/_FTM2_CH0: U$50.9 ; also sheet 1
PTE6_/_ADC1_SE11: JP14.5 ; also sheet 1
PTE13_/_FTM2_FLT0: U$50.2 ; also sheet 1
PWT_IN1_/_FXIO_D5: JP10.6 ; also sheet 1
RTC_CLK_OUT_/_FTM2_CH4: U$50.5 ; also sheet 1
VDD: JP6.1 JP6.2 JP6.3 JP12.1 JP12.2 JP12.3 ; supply symbol labelled +VDD ; also sheet 1,5,6
Unconnected: JP6.6 JP12.6

### Notes on the sheet
- POWER
- add GND point for oscilliscope
- PWM
- SERVO_LEFT
- SERVO_RIGHT
- BLDC_ESC
- FXIO
- I2C_SCK
- I2C_SDA
- ACMP_IN_OUT
- ADC
- IMU_INT
- BMS
- DIGITAL

## Library data of the parts
C1-C10 C12-C16 C18-C22 = RobotRacing2019_Master:CAP0603
C11 C17 = RobotRacing2019_Master:CAP0603; SPICEPREFIX: C
CN1 = adafruit:USB: USB Connectors USBMINIB - Surface Mount Female Mini-B USB Connector 4UConnector: 06564 By microbuilder.eu Thru-hole RA Female Mini-B USB Connector 4UConnector: 18732 By ladyada.net
D1-D8 = RobotRacing2019_Master:LED0603
FB1 = RobotRacing2019_Master:FERRITE_BEAD
J1 = RobotRacing2019_Master:10-PIN_SWD
J2-J4 J7 J9 J10 J15-J20 = RobotRacing2019_Master:PINHEAD-4-VERTICAL
J5 J6 J8 = RobotRacing2019_Master:PINHEAD-6-VERTICAL
J11-J13 = RobotRacing2019_Master:PINHEAD-3-VERTICAL
J14 = RobotRacing2019_Master:PINHEAD-2-VERTICAL
JP1-JP5 JP7 = adafruit:PINHD-1X3: PIN HEADER
JP6 JP8-JP12 JP14 = adafruit:PINHD-1X8: PIN HEADER
L1 = RobotRacing2019_Master:IND0603
L2 = RobotRacing2019_Master:CHOKE0603
POWER_ON/OFF RACE/DEBUG RC/AUTO = switch:320-916: TOGGLE SWITCH distributor RS Components
Q1 Q2 = RobotRacing2019_Master:NMOS_SOT23
Q3 = RobotRacing2019_Master:PMOS_SOT23
R1-R31 = RobotRacing2019_Master:RES0603
S1 S2 = RobotRacing2019_Master:TACT_SWITCH_6X6_SMT
U1 = RobotRacing2019_Master:MPU-9250(IMU)
U2 = microbuilder:FT232RL: FTDI FT232RL USB TO RS232 Converter Digikey: 768-1007-1-ND
U$1 = RobotRacing2019_Master:MKE14F512LL16: ARM® Cortex®-M4F Kinetis KE1xF Microcontroller IC 32-Bit 168MHz 512KB (512K x 8) FLASH 100-LQFP (14x14)
U$12 = RobotRacing2019_Master:TEAM_LOGO
U$38 = RobotRacing2019_Master:BOARD_INFO
U$50 = adafruit:PINHD-1X10: Pin header 1x10 0.1" spacing With round pins
VR1 = RobotRacing2019_Master:MIC5501